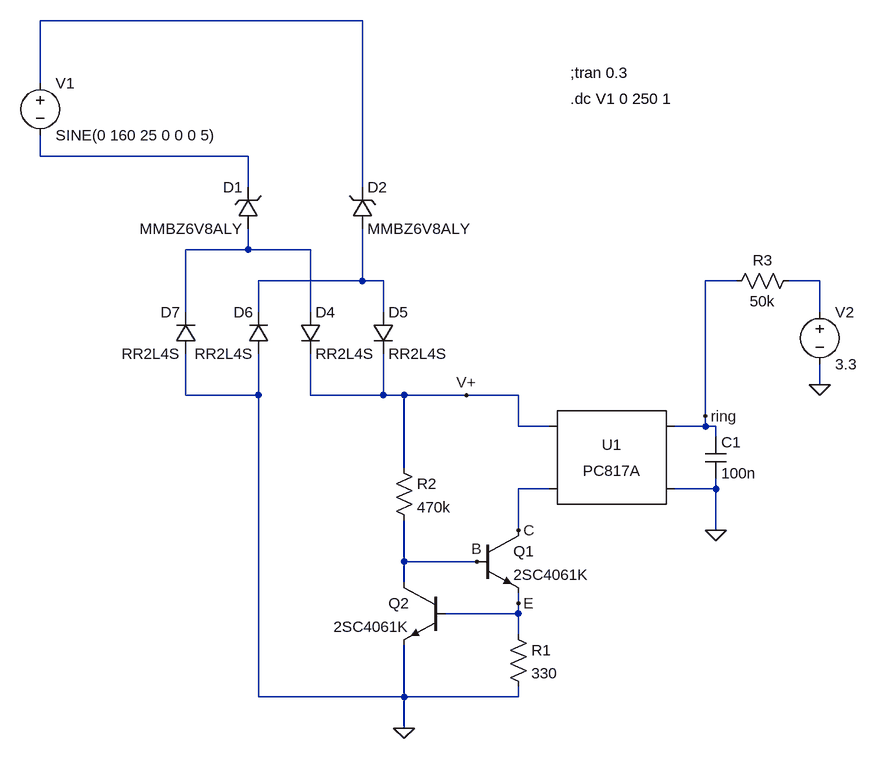
[diagram p0: schematic current_source.asc]
current_source.asc, the LTspice schematic file:
Version 4
SHEET 1 880 852
WIRE -272 -256 -768 -256
WIRE -768 -160 -768 -256
WIRE -768 -48 -768 -80
WIRE -448 -48 -768 -48
WIRE -448 0 -448 -48
WIRE -272 0 -272 -256
WIRE -448 96 -448 64
WIRE -448 96 -544 96
WIRE -352 96 -448 96
WIRE -272 144 -272 64
WIRE -272 144 -432 144
WIRE -240 144 -272 144
WIRE 304 144 256 144
WIRE 432 144 384 144
WIRE -544 192 -544 96
WIRE -432 192 -432 144
WIRE -352 192 -352 96
WIRE -240 192 -240 144
WIRE 432 192 432 144
WIRE 432 304 432 272
WIRE -544 320 -544 256
WIRE -432 320 -432 256
WIRE -432 320 -544 320
WIRE -352 320 -352 256
WIRE -240 320 -240 256
WIRE -240 320 -352 320
WIRE -208 320 -240 320
WIRE -112 320 -208 320
WIRE -32 320 -112 320
WIRE 256 352 256 144
WIRE -32 368 -32 320
WIRE 16 368 -32 368
WIRE 256 368 256 352
WIRE 256 368 208 368
WIRE 272 368 256 368
WIRE 272 384 272 368
WIRE -208 432 -208 320
WIRE 16 464 -32 464
WIRE 272 464 272 448
WIRE 272 464 208 464
WIRE -32 528 -32 464
WIRE 272 528 272 464
WIRE -208 576 -208 512
WIRE -96 576 -208 576
WIRE -208 608 -208 576
WIRE -32 640 -32 624
WIRE -32 656 -32 640
WIRE -32 656 -144 656
WIRE -32 688 -32 656
WIRE -432 784 -432 320
WIRE -208 784 -208 704
WIRE -208 784 -432 784
WIRE -32 784 -32 768
WIRE -32 784 -208 784
WIRE -208 832 -208 784
FLAG -208 832 0
FLAG -96 576 B
FLAG -32 528 C
FLAG -32 640 E
FLAG -112 320 V+
FLAG 272 528 0
FLAG 256 352 ring
FLAG 432 304 0
SYMBOL voltage -768 -176 R0
WINDOW 123 0 0 Left 0
WINDOW 39 0 0 Left 0
SYMATTR InstName V1
SYMATTR Value SINE(0 160 25 0 0 0 5)
SYMBOL npn -96 528 R0
SYMATTR InstName Q1
SYMATTR Value 2SC4061K
SYMBOL res -48 672 R0
SYMATTR InstName R1
SYMATTR Value 330
SYMBOL npn -144 608 M0
SYMATTR InstName Q2
SYMATTR Value 2SC4061K
SYMBOL res -224 416 R0
SYMATTR InstName R2
SYMATTR Value 470k
SYMBOL zener -432 64 R180
WINDOW 0 24 64 Left 2
WINDOW 3 24 0 Left 2
SYMATTR InstName D1
SYMATTR Value MMBZ6V8ALY
SYMATTR Description Diode
SYMATTR Type diode
SYMBOL zener -288 64 M180
WINDOW 0 24 64 Left 2
WINDOW 3 24 0 Left 2
SYMATTR InstName D2
SYMATTR Value MMBZ6V8ALY
SYMATTR Description Diode
SYMATTR Type diode
SYMBOL diode -368 192 R0
SYMATTR InstName D4
SYMATTR Value RR2L4S
SYMBOL diode -256 192 R0
SYMATTR InstName D5
SYMATTR Value RR2L4S
SYMBOL diode -416 256 R180
WINDOW 0 24 64 Left 2
WINDOW 3 24 0 Left 2
SYMATTR InstName D6
SYMATTR Value RR2L4S
SYMBOL diode -528 256 R180
WINDOW 0 24 64 Left 2
WINDOW 3 24 0 Left 2
SYMATTR InstName D7
SYMATTR Value RR2L4S
SYMBOL Optos\\PC817A 112 416 R0
SYMATTR InstName U1
SYMBOL voltage 432 176 R0
WINDOW 123 0 0 Left 0
WINDOW 39 0 0 Left 0
SYMATTR InstName V2
SYMATTR Value 3.3
SYMBOL res 400 128 R90
WINDOW 0 0 56 VBottom 2
WINDOW 3 32 56 VTop 2
SYMATTR InstName R3
SYMATTR Value 50k
SYMBOL cap 256 384 R0
SYMATTR InstName C1
SYMATTR Value 100n
TEXT 48 -136 Left 2 !.dc V1 0 250 1
TEXT 48 -176 Left 2 !;tran 0.3

The netlist it stands for:
* current_source.asc
V1 N001 N002 SINE(0 160 25 0 0 0 5)
Q1 C B E 0 2SC4061K
R1 E 0 330
Q2 B E 0 0 2SC4061K
R2 V+ B 470k
D1 N003 N002 MMBZ6V8ALY
D2 N004 N001 MMBZ6V8ALY
D4 N003 V+ RR2L4S
D5 N004 V+ RR2L4S
D6 0 N004 RR2L4S
D7 0 N003 RR2L4S
XU1 V+ C ring 0 PC817 Igain=1m
V2 N005 0 3.3
R3 N005 ring 50k
C1 ring 0 100n
.model D D
.lib standard.dio
.model NPN NPN
.model PNP PNP
.lib standard.bjt
.dc V1 0 250 1
;tran 0.3
.lib PC817.sub
.backanno
.end